# Altium schematic sheet ethernet.SchDoc
size B
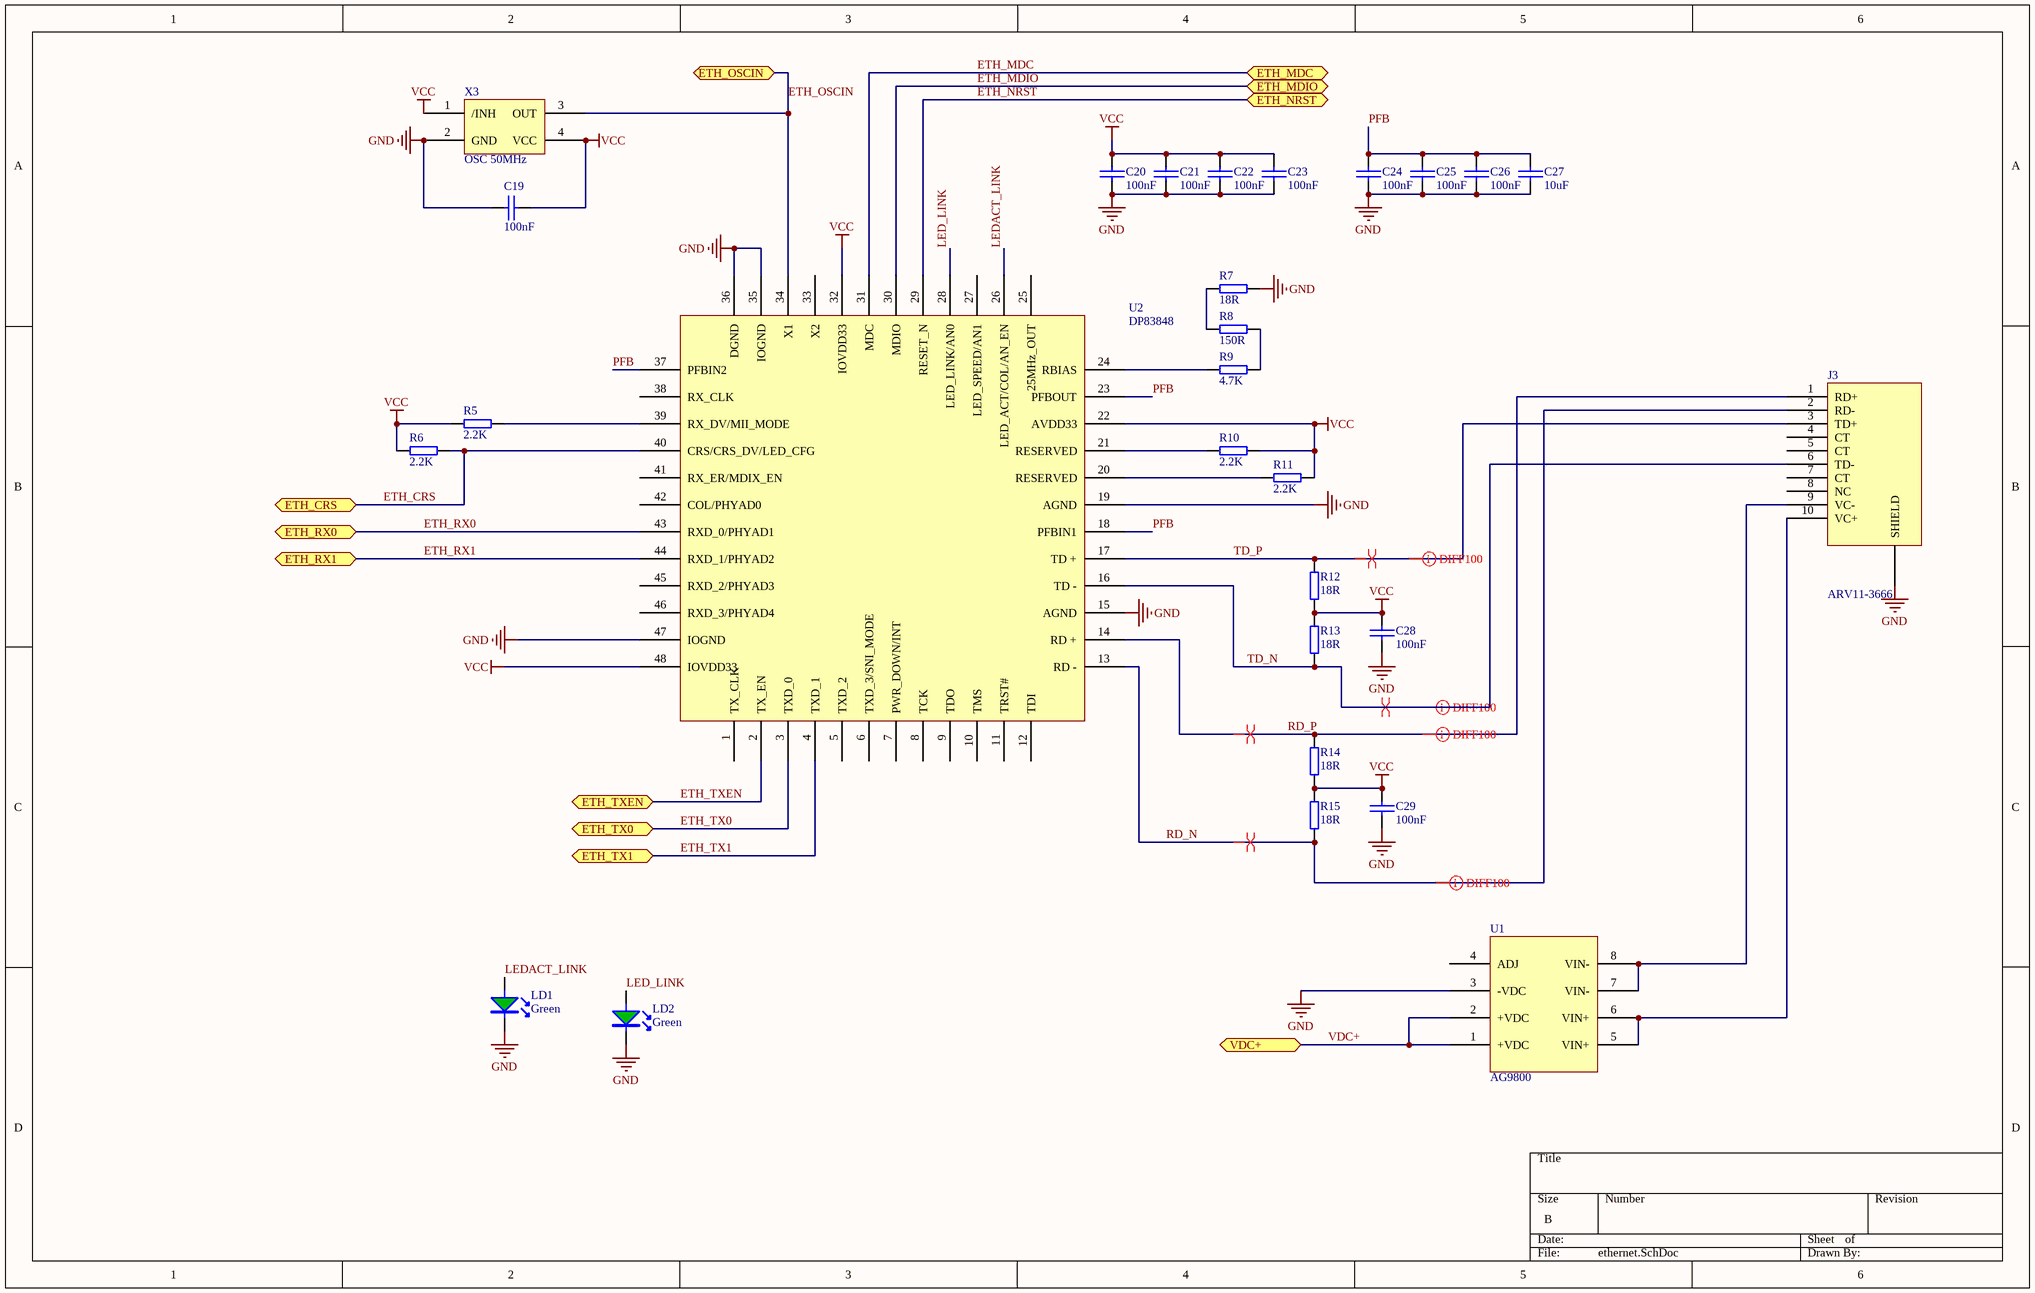
[diagram p0: ethernet.SchDoc]

## Parts
C19  100nF  [0603-IPC]
C20  100nF  [0603-IPC]
C21  100nF  [0603-IPC]
C22  100nF  [0603-IPC]
C23  100nF  [0603-IPC]
C24  100nF  [0603-IPC]
C25  100nF  [0603-IPC]
C26  100nF  [0603-IPC]
C27  10uF  [0603-IPC]
C28  100nF  [0603-IPC]
C29  100nF  [0603-IPC]
J3  ARV11-3666  [ARV11-3666]
LD1  Green  [LED 0603-IPC]
LD2  Green  [LED 0603-IPC]
R5  2.2K  [0603-IPC]
R6  2.2K  [0603-IPC]
R7  18R  [0603-IPC]
R8  150R  [0603-IPC]
R9  4.7K  [0603-IPC]
R10  2.2K  [0603-IPC]
R11  2.2K  [0603-IPC]
R12  18R  [0603-IPC]
R13  18R  [0603-IPC]
R14  18R  [0603-IPC]
R15  18R  [0603-IPC]
U1  AG9800  [AG9800]
U2  DP83848  [LQFP48_L]
X3  OSC 50MHz  [Clock Osc]

## Ports
ETH_CRS (bidir), ETH_MDC (bidir), ETH_MDIO (bidir), ETH_NRST (bidir), ETH_OSCIN (bidir), ETH_RX0 (bidir), ETH_RX1 (bidir), ETH_TX0 (bidir), ETH_TX1 (bidir), ETH_TXEN (bidir), VDC+ (bidir)

## Nets
GND: C19.2 C20.2 C21.2 C22.2 C23.2 C24.2 C25.2 C26.2 C27.2 C28.2 C29.2 J3.11(SHIELD) LD1.K LD2.K R7.1 U1.3(-VDC) U2.15(AGND) U2.19(AGND) U2.35(IOGND) U2.36(DGND) U2.47(IOGND) X3.2(GND)
VCC: C19.1 C20.1 C21.1 C22.1 C23.1 C28.1 C29.1 R5.2 R6.2 R10.1 R11.1 R12.2 R13.1 R14.2 R15.1 U2.22(AVDD33) U2.32(IOVDD33) U2.48(IOVDD33) X3.1(/INH) X3.4(VCC)
ETH_CRS: R6.1 U2.40(CRS/CRS_DV/LED_CFG) ; port ETH_CRS
ETH_MDC: U2.31(MDC) ; port ETH_MDC
ETH_MDIO: U2.30(MDIO) ; port ETH_MDIO
ETH_NRST: U2.29(RESET_N) ; port ETH_NRST
ETH_OSCIN: U2.34(X1) X3.3(OUT) ; port ETH_OSCIN
ETH_RX0: U2.43(RXD_0/PHYAD1) ; port ETH_RX0
ETH_RX1: U2.44(RXD_1/PHYAD2) ; port ETH_RX1
ETH_TX0: U2.3(TXD_0) ; port ETH_TX0
ETH_TX1: U2.4(TXD_1) ; port ETH_TX1
ETH_TXEN: U2.2(TX_EN) ; port ETH_TXEN
LED_LINK: LD2.A U2.28(LED_LINK/AN0)
LEDACT_LINK: LD1.A U2.26(LED_ACT/COL/AN_EN)
PFB: C24.1 C25.1 C26.1 C27.1 U2.18(PFBIN1) U2.23(PFBOUT) U2.37(PFBIN2)
RD_N: J3.2(RD-) R15.2 U2.13(RD_-)
RD_P: J3.1(RD+) R14.1 U2.14(RD_+)
TD_N: J3.6(TD-) R13.2 U2.16(TD_-)
TD_P: J3.3(TD+) R12.1 U2.17(TD_+)
VDC+: U1.1(+VDC) U1.2(+VDC) ; port VDC+
NetJ3_9: J3.9(VC-) U1.7(VIN-) U1.8(VIN-)
NetJ3_10: J3.10(VC+) U1.5(VIN+) U1.6(VIN+)
NetR5_1: R5.1 U2.39(RX_DV/MII_MODE)
NetR7_2: R7.2 R8.2
NetR8_1: R8.1 R9.1
NetR9_2: R9.2 U2.24(RBIAS)
NetR10_2: R10.2 U2.21(RESERVED)
NetR11_2: R11.2 U2.20(RESERVED)

Not connected (* = marked no-connect by the designer): J3 4(CT) 5(CT) 7(CT) 8(NC); U1 4(ADJ); U2 1(TX_CLK) 5(TXD_2) 6(TXD_3/SNI_MODE) 7(PWR_DOWN/INT) 8(TCK) 9(TDO) 10(TMS) 11(TRST#) 12(TDI) 25(25MHz_OUT) 27(LED_SPEED/AN1) 33(X2) 38(RX_CLK) 41(RX_ER/MDIX_EN) 42(COL/PHYAD0) 45(RXD_2/PHYAD3) 46(RXD_3/PHYAD4)

## Layout directives
differential pair: RD_N, RD_P, TD_N, TD_P
DIFF100: 100: RD_N, RD_P, TD_N, TD_P

## Library data of the parts
C19-C29 = CAP 0603 XXX: 0.01uF 50V
LD1 LD2 = LED APT1608CGCK: LED Green 0603 Straight; Manufacturer: Kingsbright; Lens: Clear; Vf: 2.1V; View Angle: 120°; Vr: 5V; Current: 20mA; Wavelength: 570nm; Power: 75mW; Colour: Green; Orientation: Straight; Value: Green; Manufacturer P/N: APT1608CGCK; Case: 0603; Size: 1.6mm x 0.8mm x 0.75mm; Digikey P/N: 754-1116-1-ND; Technology: SMD; Supplier 1: Digi-Key; Supplier Part Number 1: 754-1116-2-ND
R5-R15 = RES 0603 XXX: RES0603
X3 = KC3225A-C3